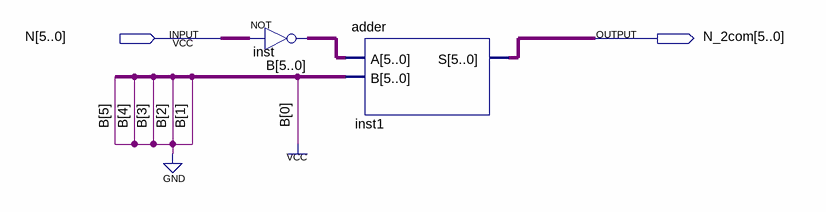
[diagram p0: schematic sheet]
// Quartus schematic twos_complement.bdf as structural Verilog: 2 symbols, 2 pins
module twos_complement (
  input  [5:0] N,
  output [5:0] N_2com
);

  wire [5:0] inst_out;

  assign inst_out = ~N;  // NOT inst, 6 bits wide
  adder inst1 (.A(inst_out), .B(6'b000001), .S(N_2com));
endmodule
